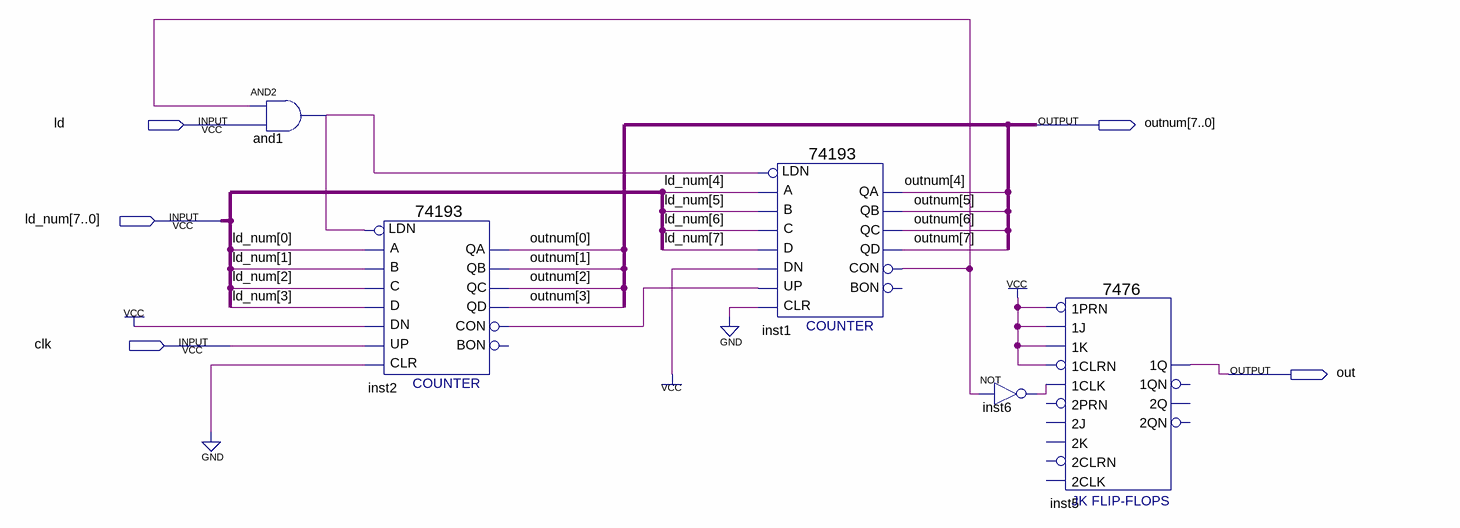
[diagram p0: schematic sheet]
// Quartus schematic fpga_counter.bdf as structural Verilog: 5 symbols, 5 pins
module fpga_counter (
  input  ld,
  input  [7:0] ld_num,
  input  clk,
  output [7:0] outnum,
  output out
);

  wire and1_out, inst1_con, inst2_con, inst6_out;

  and and1 (and1_out, inst1_con, ld);
  \74193  inst2 (
    .D(ld_num[3]), .C(ld_num[2]), .B(ld_num[1]), .A(ld_num[0]), .CLR(1'b0), .UP(clk), .DN(1'b1),
    .LDN(and1_out), .QB(outnum[1]), .QA(outnum[0]), .CON(inst2_con), .QD(outnum[3]), .QC(outnum[2]));  // open: BON
  \74193  inst1 (
    .D(ld_num[7]), .C(ld_num[6]), .B(ld_num[5]), .A(ld_num[4]), .CLR(1'b0), .UP(inst2_con), .DN(1'b1),
    .LDN(and1_out), .QB(outnum[5]), .QA(outnum[4]), .CON(inst1_con), .QD(outnum[7]), .QC(outnum[6]));  // open: BON
  not inst6 (inst6_out, inst1_con);
  \7476  inst5 (
    .\1J (1'b1), .\1K (1'b1), .\1PRN (1'b1), .\1CLK (inst6_out), .\1CLRN (1'b1), .\1Q (out));  // open: 2PRN, 2J, 2K, 2CLRN, 2CLK, 2QN, 2Q, 1QN
endmodule
